# EasyEDA Pro project ProPrj_HTXStudio_OneHanded_Keyboard.epro, schematic 键盘控制
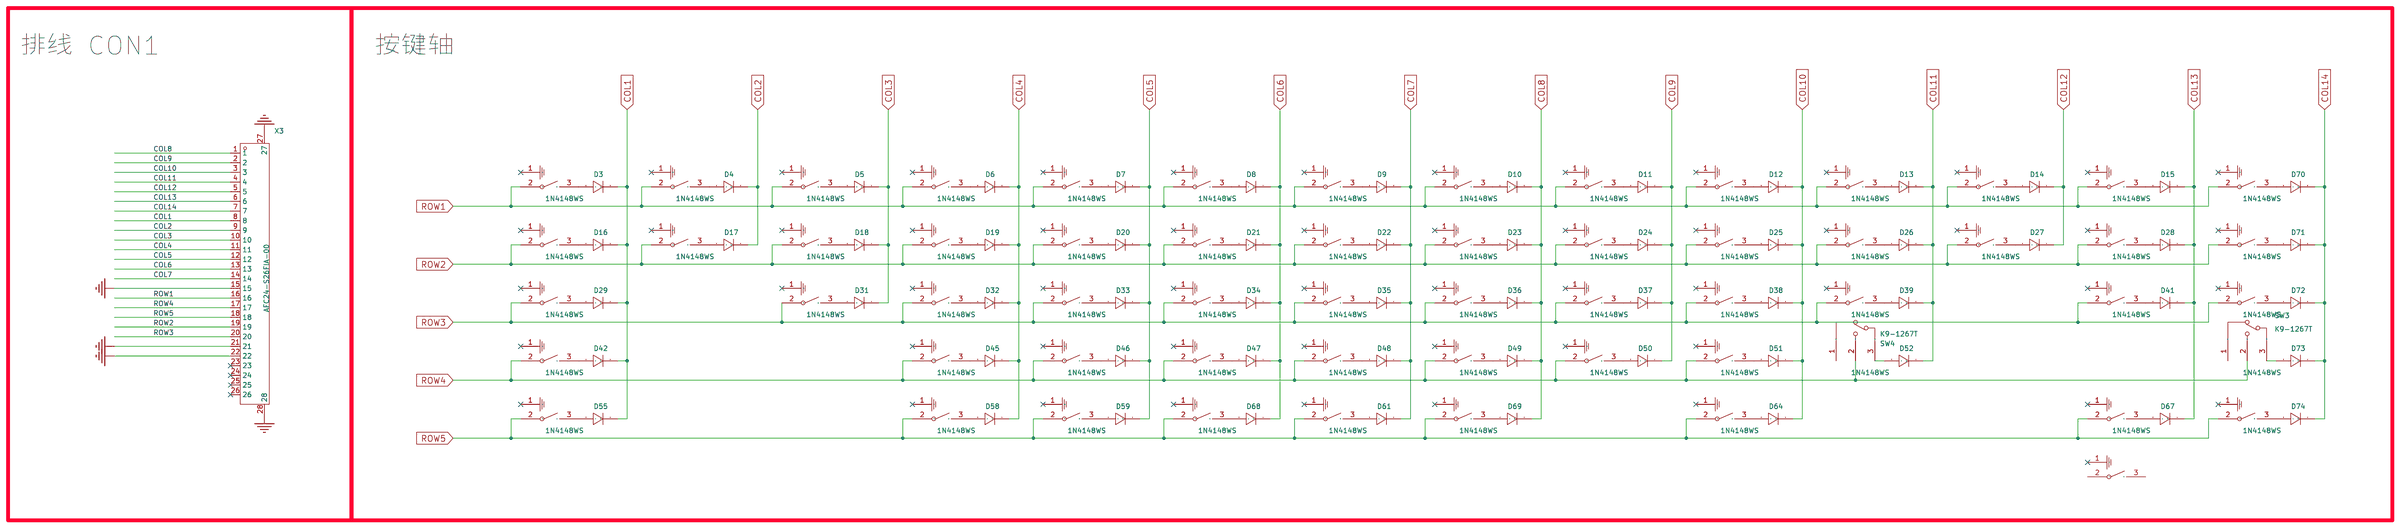
[diagram p4: schematic sheet]

## Parts
D3  1N4148WS  [SOD-323_L1.8-W1.3-LS2.5-RD]
D4  1N4148WS  [SOD-323_L1.8-W1.3-LS2.5-RD]
D5  1N4148WS  [SOD-323_L1.8-W1.3-LS2.5-RD]
D6  1N4148WS  [SOD-323_L1.8-W1.3-LS2.5-RD]
D7  1N4148WS  [SOD-323_L1.8-W1.3-LS2.5-RD]
D8  1N4148WS  [SOD-323_L1.8-W1.3-LS2.5-RD]
D9  1N4148WS  [SOD-323_L1.8-W1.3-LS2.5-RD]
D10  1N4148WS  [SOD-323_L1.8-W1.3-LS2.5-RD]
D11  1N4148WS  [SOD-323_L1.8-W1.3-LS2.5-RD]
D12  1N4148WS  [SOD-323_L1.8-W1.3-LS2.5-RD]
D13  1N4148WS  [SOD-323_L1.8-W1.3-LS2.5-RD]
D14  1N4148WS  [SOD-323_L1.8-W1.3-LS2.5-RD]
D15  1N4148WS  [SOD-323_L1.8-W1.3-LS2.5-RD]
D16  1N4148WS  [SOD-323_L1.8-W1.3-LS2.5-RD]
D17  1N4148WS  [SOD-323_L1.8-W1.3-LS2.5-RD]
D18  1N4148WS  [SOD-323_L1.8-W1.3-LS2.5-RD]
D19  1N4148WS  [SOD-323_L1.8-W1.3-LS2.5-RD]
D20  1N4148WS  [SOD-323_L1.8-W1.3-LS2.5-RD]
D21  1N4148WS  [SOD-323_L1.8-W1.3-LS2.5-RD]
D22  1N4148WS  [SOD-323_L1.8-W1.3-LS2.5-RD]
D23  1N4148WS  [SOD-323_L1.8-W1.3-LS2.5-RD]
D24  1N4148WS  [SOD-323_L1.8-W1.3-LS2.5-RD]
D25  1N4148WS  [SOD-323_L1.8-W1.3-LS2.5-RD]
D26  1N4148WS  [SOD-323_L1.8-W1.3-LS2.5-RD]
D27  1N4148WS  [SOD-323_L1.8-W1.3-LS2.5-RD]
D28  1N4148WS  [SOD-323_L1.8-W1.3-LS2.5-RD]
D29  1N4148WS  [SOD-323_L1.8-W1.3-LS2.5-RD]
D31  1N4148WS  [SOD-323_L1.8-W1.3-LS2.5-RD]
D32  1N4148WS  [SOD-323_L1.8-W1.3-LS2.5-RD]
D33  1N4148WS  [SOD-323_L1.8-W1.3-LS2.5-RD]
D34  1N4148WS  [SOD-323_L1.8-W1.3-LS2.5-RD]
D35  1N4148WS  [SOD-323_L1.8-W1.3-LS2.5-RD]
D36  1N4148WS  [SOD-323_L1.8-W1.3-LS2.5-RD]
D37  1N4148WS  [SOD-323_L1.8-W1.3-LS2.5-RD]
D38  1N4148WS  [SOD-323_L1.8-W1.3-LS2.5-RD]
D39  1N4148WS  [SOD-323_L1.8-W1.3-LS2.5-RD]
D41  1N4148WS  [SOD-323_L1.8-W1.3-LS2.5-RD]
D42  1N4148WS  [SOD-323_L1.8-W1.3-LS2.5-RD]
D45  1N4148WS  [SOD-323_L1.8-W1.3-LS2.5-RD]
D46  1N4148WS  [SOD-323_L1.8-W1.3-LS2.5-RD]
D47  1N4148WS  [SOD-323_L1.8-W1.3-LS2.5-RD]
D48  1N4148WS  [SOD-323_L1.8-W1.3-LS2.5-RD]
D49  1N4148WS  [SOD-323_L1.8-W1.3-LS2.5-RD]
D50  1N4148WS  [SOD-323_L1.8-W1.3-LS2.5-RD]
D51  1N4148WS  [SOD-323_L1.8-W1.3-LS2.5-RD]
D52  1N4148WS  [SOD-323_L1.8-W1.3-LS2.5-RD]
D55  1N4148WS  [SOD-323_L1.8-W1.3-LS2.5-RD]
D58  1N4148WS  [SOD-323_L1.8-W1.3-LS2.5-RD]
D59  1N4148WS  [SOD-323_L1.8-W1.3-LS2.5-RD]
D61  1N4148WS  [SOD-323_L1.8-W1.3-LS2.5-RD]
D64  1N4148WS  [SOD-323_L1.8-W1.3-LS2.5-RD]
D67  1N4148WS  [SOD-323_L1.8-W1.3-LS2.5-RD]
D68  1N4148WS  [SOD-323_L1.8-W1.3-LS2.5-RD]
D69  1N4148WS  [SOD-323_L1.8-W1.3-LS2.5-RD]
D70  1N4148WS  [SOD-323_L1.8-W1.3-LS2.5-RD]
D71  1N4148WS  [SOD-323_L1.8-W1.3-LS2.5-RD]
D72  1N4148WS  [SOD-323_L1.8-W1.3-LS2.5-RD]
D73  1N4148WS  [SOD-323_L1.8-W1.3-LS2.5-RD]
D74  1N4148WS  [SOD-323_L1.8-W1.3-LS2.5-RD]
K1  -  [ALPS_键盘轴]
K2  -  [ALPS_键盘轴]
K3  -  [ALPS_键盘轴]
K4  -  [ALPS_键盘轴]
K5  -  [ALPS_键盘轴]
K6  -  [ALPS_键盘轴]
K7  -  [ALPS_键盘轴]
K8  -  [ALPS_键盘轴]
K9  -  [ALPS_键盘轴]
K10  -  [ALPS_键盘轴]
K11  -  [ALPS_键盘轴]
K12  -  [ALPS_键盘轴]
K13  -  [ALPS_键盘轴]
K14  -  [ALPS_键盘轴]
K15  -  [ALPS_键盘轴]
K16  -  [ALPS_键盘轴]
K17  -  [ALPS_键盘轴]
K18  -  [ALPS_键盘轴]
K19  -  [ALPS_键盘轴]
K20  -  [ALPS_键盘轴]
K21  -  [ALPS_键盘轴]
K22  -  [ALPS_键盘轴]
K23  -  [ALPS_键盘轴]
K24  -  [ALPS_键盘轴]
K25  -  [ALPS_键盘轴]
K26  -  [ALPS_键盘轴]
K27  -  [ALPS_键盘轴]
K29  -  [ALPS_键盘轴]
K30  -  [ALPS_键盘轴]
K31  -  [ALPS_键盘轴]
K32  -  [ALPS_键盘轴]
K33  -  [ALPS_键盘轴]
K34  -  [ALPS_键盘轴]
K35  -  [ALPS_键盘轴]
K36  -  [ALPS_键盘轴]
K37  -  [ALPS_键盘轴]
K39  -  [ALPS_键盘轴]
K40  -  [ALPS_键盘轴]
K43  -  [ALPS_键盘轴]
K44  -  [ALPS_键盘轴]
K45  -  [ALPS_键盘轴]
K46  -  [ALPS_键盘轴]
K47  -  [ALPS_键盘轴]
K48  -  [ALPS_键盘轴]
K49  -  [ALPS_键盘轴]
K53  -  [ALPS_键盘轴]
K56  -  [ALPS_键盘轴]
K57  -  [ALPS_键盘轴]
K59  -  [ALPS_键盘轴]
K62  -  [ALPS_键盘轴]
K65  -  [ALPS_键盘轴]
K66  -  [ALPS_键盘轴]
K67  -  [ALPS_键盘轴]
K68  -  [ALPS_键盘轴]
K69  -  [ALPS_键盘轴]
K70  -  [ALPS_键盘轴]
K72  -  [ALPS_键盘轴]
K73  -  [ALPS_键盘轴]
SW3  K9-1267T  [SW-TH_K9-1267T]
SW4  K9-1267T  [SW-TH_K9-1267T]
X3  AFC24-S26FIA-00  [FPC-SMD_AFC24-S26FIA]

## Library data of the parts
D3-D29 D31-D39 D41 D42 D45-D52 D55 D58 D59 D61 D64 D67-D74 = 1N4148WS_C437156: 二极管配置:独立式;正向压降(Vf):1.25V@150mA;直流反向耐压(Vr):100V;整流电流:150mA;反向恢复时间(trr):4ns;; LCSC Part Name: 电压:100V 电流:150mA; Supplier Part: C437156; Manufacturer: MDD(辰达半导体); Supplier Footprint: SOD-323; JLCPCB Part Class: 扩展库; Datasheet: https://atta.szlcsc.com/upload/public/pdf/source/20230823/12C4B88004F768DBC940AB716F9D26AA.pdf; Supplier: LCSC; Diode Configuration: 独立式; Forward Voltage (Vf@If): 1.25V@150mA; Reverse Voltage (Vr): 100V; Rectified Current: 150mA; Reverse Leakage Current: 25nA@20V; Reverse Recovery Time (trr): 4ns; Operating Temperature: -55℃~+150℃@(Tj)
K1-K27 K29-K37 K39 K40 K43-K49 K53 K56 K57 K59 K62 K65-K70 K72 K73 = ALPS_键盘轴
SW3 SW4 = K9-1267T: 类型:微动开关;电路结构:单刀双掷;额定电流(DC):100mA;额定电压(DC):30V;额定电流(AC):-;额定电压(AC):-;机械寿命:300万次;; LCSC Part Name: 12.7*5.7*7.5mm 插件微动开关; Supplier Part: C107266; Manufacturer: 韩国韩荣; Supplier Footprint: 插件; JLCPCB Part Class: 扩展库; Datasheet: https://atta.szlcsc.com/upload/public/pdf/source/20170413/1492062748888.pdf; Supplier: LCSC; Type: 微动开关; Circuit: 单刀双掷; Switch Length: 12.7mm; Switch Width: 5.7mm; Switch Height: 7.5mm; Contact Current (DC): 100mA; Voltage Rating (DC): 30V; Mechanical Life: 300万次; Operating Temperature: -25℃~+85℃
X3 = AFC24-S26FIA-00: 锁定特性:翻盖式;触点类型:双侧触点/上下接;触点数量:26P;间距:0.5mm;安装类型:卧贴;工作温度范围:-;; LCSC Part Name: 间距:0.5mm P数:26P 翻盖式 双侧触点/上下接; Supplier Part: C262684; Manufacturer: JS(钜硕电子); Supplier Footprint: SMD,P=0.5mm,卧贴; JLCPCB Part Class: 扩展库; Datasheet: https://atta.szlcsc.com/upload/public/pdf/source/20201020/C262682_4418ACDA99370B54C7579F9B07EB16A1.pdf; Supplier: LCSC; Locking Feature: 翻盖式; Contact Type: 双侧触点/上下接; Number of Contacts: 26P; Pitch: 0.5mm; Mounting Type: 卧贴; FFC, FCB Thickness: 0.3mm; Height Above Board: 2mm

## Nets
GND: X3.15 X3.21 X3.22 X3.27 X3.28
COL1: D3.1(C) D16.1(C) D29.1(C) D42.1(C) D55.1(C) X3.8
COL2: D4.1(C) D17.1(C) X3.9
COL3: D5.1(C) D18.1(C) D31.1(C) X3.10
COL4: D6.1(C) D19.1(C) D32.1(C) D45.1(C) D58.1(C) X3.11
COL5: D7.1(C) D20.1(C) D33.1(C) D46.1(C) D59.1(C) X3.12
COL6: D8.1(C) D21.1(C) D34.1(C) D47.1(C) D68.1(C) X3.13
COL7: D9.1(C) D22.1(C) D35.1(C) D48.1(C) D61.1(C) X3.14
COL8: D10.1(C) D23.1(C) D36.1(C) D49.1(C) D69.1(C) X3.1
COL9: D11.1(C) D24.1(C) D37.1(C) D50.1(C) X3.2
COL10: D12.1(C) D25.1(C) D38.1(C) D51.1(C) D64.1(C) X3.3
COL11: D13.1(C) D26.1(C) D39.1(C) D52.1(C) X3.4
COL12: D14.1(C) D27.1(C) X3.5
COL13: D15.1(C) D28.1(C) D41.1(C) D67.1(C) X3.6
COL14: D70.1(C) D71.1(C) D72.1(C) D73.1(C) D74.1(C) X3.7
ROW1: K1.2 K2.2 K3.2 K4.2 K5.2 K6.2 K7.2 K8.2 K9.2 K10.2 K11.2 K12.2 K13.2 K68.2 X3.16
ROW2: K14.2 K15.2 K16.2 K17.2 K18.2 K19.2 K20.2 K21.2 K22.2 K23.2 K24.2 K25.2 K26.2 K69.2 X3.19
ROW3: K27.2 K29.2 K30.2 K31.2 K32.2 K33.2 K34.2 K35.2 K36.2 K37.2 K39.2 K70.2 X3.20
ROW4: K40.2 K43.2 K44.2 K45.2 K46.2 K47.2 K48.2 K49.2 SW3.2(ON) SW4.2(ON) X3.17
ROW5: K53.2 K56.2 K57.2 K59.2 K62.2 K65.2 K66.2 K67.2 K72.2 X3.18
$2N1898: D3.2(A) K2.3
$2N1937: D4.2(A) K1.3
$2N1976: D5.2(A) K3.3
$2N2015: D6.2(A) K4.3
$2N2054: D7.2(A) K5.3
$2N2093: D8.2(A) K6.3
$2N2132: D9.2(A) K7.3
$2N2171: D10.2(A) K8.3
$2N2210: D11.2(A) K9.3
$2N2249: D12.2(A) K10.3
$2N2288: D13.2(A) K11.3
$2N2327: D14.2(A) K12.3
$2N2366: D15.2(A) K13.3
$2N4045: D16.2(A) K14.3
$2N4047: D17.2(A) K15.3
$2N4049: D18.2(A) K16.3
$2N4051: D19.2(A) K17.3
$2N4053: D20.2(A) K18.3
$2N4055: D21.2(A) K19.3
$2N4057: D22.2(A) K20.3
$2N4059: D23.2(A) K21.3
$2N4061: D24.2(A) K22.3
$2N4063: D25.2(A) K23.3
$2N4065: D26.2(A) K24.3
$2N4067: D27.2(A) K25.3
$2N4069: D28.2(A) K26.3
$2N4890: D29.2(A) K27.3
$2N4894: D31.2(A) K29.3
$2N4896: D32.2(A) K30.3
$2N4898: D33.2(A) K31.3
$2N4900: D34.2(A) K32.3
$2N4902: D35.2(A) K33.3
$2N4904: D36.2(A) K34.3
$2N4906: D37.2(A) K35.3
$2N4908: D38.2(A) K36.3
$2N4910: D39.2(A) K37.3
$2N4914: D41.2(A) K39.3
$2N5735: D42.2(A) K40.3
$2N5741: D45.2(A) K43.3
$2N5743: D46.2(A) K44.3
$2N5745: D47.2(A) K45.3
$2N5747: D48.2(A) K46.3
$2N5749: D49.2(A) K47.3
$2N5751: D50.2(A) K48.3
$2N5753: D51.2(A) K49.3
$2N6580: D55.2(A) K53.3
$2N6586: D58.2(A) K56.3
$2N6588: D59.2(A) K57.3
$2N6592: D61.2(A) K59.3
$2N6598: D64.2(A) K62.3
$2N6604: D67.2(A) K65.3
$2N9739: D68.2(A) K66.3
$2N9845: D69.2(A) K67.3
$2N10216: D70.2(A) K68.3
$2N10217: D71.2(A) K69.3
$2N10218: D74.2(A) K72.3
$2N10221: D72.2(A) K70.3
$2N21043: D73.2(A) SW3.3(NC)
$2N21048: D52.2(A) SW4.3(NC)

Not connected (* = marked no-connect by the designer): K1 1*; K2 1*; K3 1*; K4 1*; K5 1*; K6 1*; K7 1*; K8 1*; K9 1*; K10 1*; K11 1*; K12 1*; K13 1*; K14 1*; K15 1*; K16 1*; K17 1*; K18 1*; K19 1*; K20 1*; K21 1*; K22 1*; K23 1*; K24 1*; K25 1*; K26 1*; K27 1*; K29 1*; K30 1*; K31 1*; K32 1*; K33 1*; K34 1*; K35 1*; K36 1*; K37 1*; K39 1*; K40 1*; K43 1*; K44 1*; K45 1*; K46 1*; K47 1*; K48 1*; K49 1*; K53 1*; K56 1*; K57 1*; K59 1*; K62 1*; K65 1*; K66 1*; K67 1*; K68 1*; K69 1*; K70 1*; K72 1*; K73 1* 2 3; SW3 1(C); SW4 1(C); X3 23* 24* 25* 26*

## Notes on the sheet
- 排线 CON1
- 按键轴
